# EAGLE schematic Current Sensor PCB Schematic (EAGLE 9.7.0)
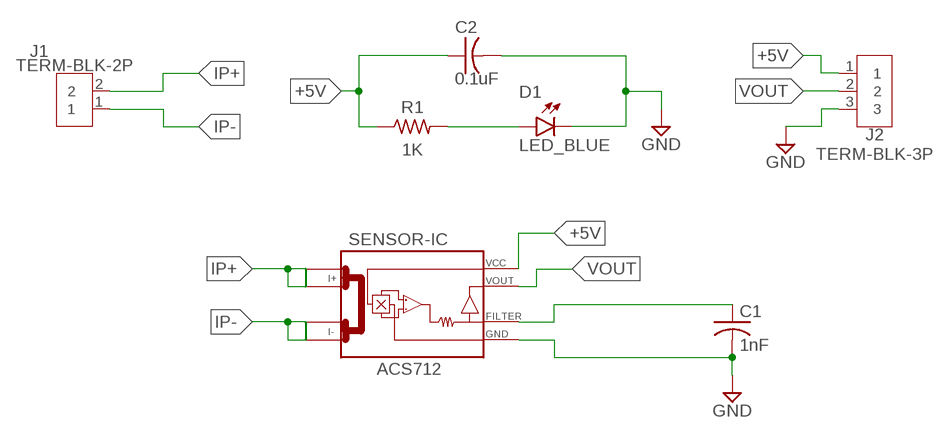
[diagram p0: schematic, sheet 1]

## Parts
C1  1nF  C-US_CHIP-0805(2012-METRIC)  [CAPC2012X110]
C2  0.1uF  C-US_CHIP-0805(2012-METRIC)  [CAPC2012X110]
D1  LED_BLUE  CHIP-FLAT-B_0805  [LEDC2012X110N_FLAT-B]
J1  TERM-BLK-2P  2828XX-2282837-2  [TERMBLK_508-2N]
J2  TERM-BLK-3P  2828XX-3282837-3  [TERMBLK_508-3N]
R1  1K  R-US_CHIP-0805(2012-METRIC)  [RESC2012X65]
SENSOR-IC  ACS712  [SO08]

## Nets
+5V: C2.1 J2.1 R1.1 SENSOR-IC.8(VCC)
GND: C1.2 C2.2 D1.C J2.3 SENSOR-IC.5(GND)
IP+: J1.2 SENSOR-IC.1(I+_0) SENSOR-IC.2(I+_1)
IP-: J1.1 SENSOR-IC.3(I-_0) SENSOR-IC.4(I-_1)
N$1: C1.1 SENSOR-IC.6(FILTER)
N$2: D1.A R1.2
VOUT: J2.2 SENSOR-IC.7(VOUT)

## Library data of the parts
C1 C2 = Capacitor:C-US: Capacitor - ANSI; CATEGORY: Capacitor
D1 = LED:CHIP-FLAT-B; CATEGORY: LED; COLOR: BLUE; DESCRIPTION: CHIP LED FLAT; SUB-CATEGORY: CHIP; TYPE: FLAT_TOP
J1 = Connector:2828XX-2: 2 Position Wire to Board Terminal Block Horizontal with Board Datasheet <https://www.te.com.cn/commerce/DocumentDelivery/DDEController?Action=showdoc&DocId=Catalog+Section%7F1308389_EUROSTYLE_TERMINAL_BLOCKS%7F0607%7Fpdf%7FEnglish%7FENG_CS_1308389_EUROSTYLE_TERMINAL_BLOCKS_0607.pdf%7F2-282837-5>; CATEGORY: Fixed Terminal Blocks; DESCRIPTION: Fixed Terminal Blocks 5.08MM PCB MOUNT 2P; MANUFACTURER: TE Connectivity AMP Connectors; MPN: 282837-2; OPERATING_TEMPERATURE: -40°C to +105°C; PART_STATUS: ACTIVE; PITCH: 0.200" (5.08mm); ROHS_COMPLIANCE: RoHS Compliant; SERIES: Buchanan; SUBCATEGORY: Terminal Blocks; TYPE: Through Hole; Screw - Rising Cage Clamp; Side wire entry, Horizontal with Board
J2 = Connector:2828XX-3: 3 Position Wire to Board Terminal Block Horizontal with Board Datasheet <https://www.te.com.cn/commerce/DocumentDelivery/DDEController?Action=showdoc&DocId=Catalog+Section%7F1308389_EUROSTYLE_TERMINAL_BLOCKS%7F0607%7Fpdf%7FEnglish%7FENG_CS_1308389_EUROSTYLE_TERMINAL_BLOCKS_0607.pdf%7F2-282837-5>; CATEGORY: Connector; DESCRIPTION: TERM BLK 3P SIDE ENT 5.08mm PCB; MANUFACTURER: TE Connectivity; MPN: 282837-3; OPERATING_TEMPERATURE: -40°C to +105°C; PART_STATUS: Active; PITCH: 0.200" (5.08mm); ROHS_COMPLIANCE: RoHS Compliant; SERIES: Buchanan; SUBCATEGORY: Terminal Block; TYPE: Side Wire Entry
R1 = Resistor:R-US: Resistor Fixed - ANSI; CATEGORY: Resistor; SUB-CATEGORY: Fixed
SENSOR-IC = ACS712-2nd:ACS712